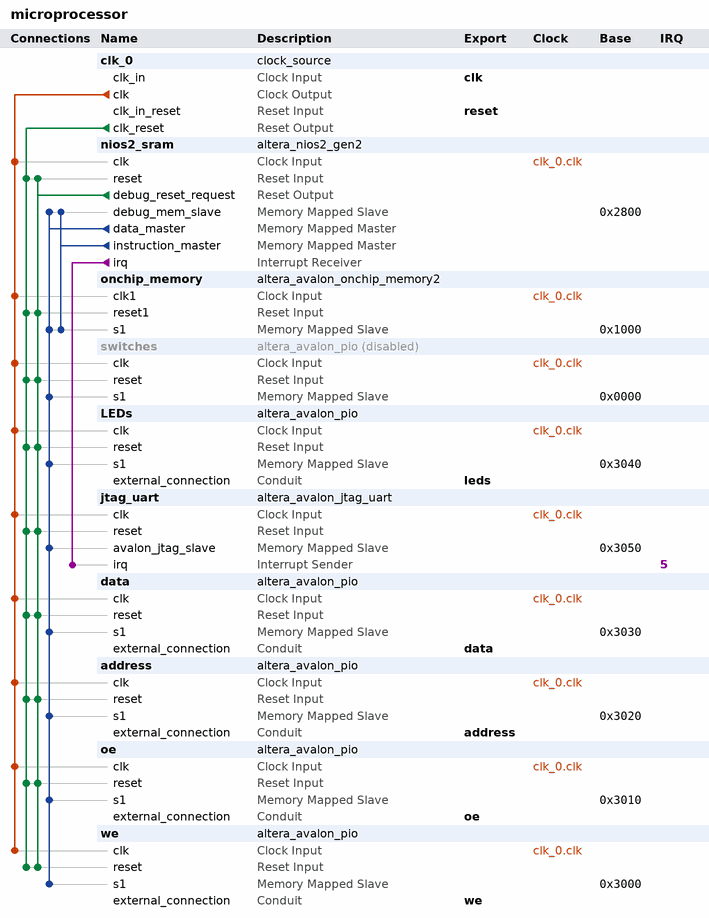
[diagram p0: system contents]
# Platform Designer (Qsys) system microprocessor, Cyclone V 5CSEMA5F31C6
# Parameters at their usual value, and those the tool derives, are not listed.
package require -exact qsys 15.1
create_system microprocessor
set_project_property DEVICE_FAMILY {Cyclone V}
set_project_property DEVICE 5CSEMA5F31C6

add_instance clk_0 clock_source 15.1
set_instance_parameter_value clk_0 clockFrequency 50000000

add_instance nios2_sram altera_nios2_gen2 15.1
set_instance_parameter_value nios2_sram dcache_size 2048
set_instance_parameter_value nios2_sram exceptionSlave onchip_memory.s1
set_instance_parameter_value nios2_sram icache_size 4096
set_instance_parameter_value nios2_sram impl Tiny
set_instance_parameter_value nios2_sram resetSlave onchip_memory.s1

add_instance onchip_memory altera_avalon_onchip_memory2 15.1
set_instance_parameter_value onchip_memory dataWidth 32
set_instance_parameter_value onchip_memory dualPort false
set_instance_parameter_value onchip_memory initMemContent true
set_instance_parameter_value onchip_memory initializationFileName onchip_mem.hex
set_instance_parameter_value onchip_memory memorySize 4096

add_instance switches altera_avalon_pio 15.1
set_instance_property switches ENABLED false
set_instance_parameter_value switches direction Input
set_instance_parameter_value switches width 8

add_instance LEDs altera_avalon_pio 15.1
set_instance_parameter_value LEDs direction Output
set_instance_parameter_value LEDs width 8

add_instance jtag_uart altera_avalon_jtag_uart 15.1
set_instance_parameter_value jtag_uart simInteractiveOptions NO_INTERACTIVE_WINDOWS

add_instance data altera_avalon_pio 15.1
set_instance_parameter_value data direction InOut
set_instance_parameter_value data width 8

add_instance address altera_avalon_pio 15.1
set_instance_parameter_value address direction Output
set_instance_parameter_value address width 8

add_instance oe altera_avalon_pio 15.1
set_instance_parameter_value oe direction Output
set_instance_parameter_value oe width 1

add_instance we altera_avalon_pio 15.1
set_instance_parameter_value we direction Output
set_instance_parameter_value we width 1

# connections
add_connection clk_0.clk address.clk clock
add_connection clk_0.clk data.clk clock
add_connection clk_0.clk jtag_uart.clk clock
add_connection clk_0.clk LEDs.clk clock
add_connection clk_0.clk nios2_sram.clk clock
add_connection clk_0.clk oe.clk clock
add_connection clk_0.clk onchip_memory.clk1 clock
add_connection clk_0.clk switches.clk clock
add_connection clk_0.clk we.clk clock
add_connection clk_0.clk_reset address.reset reset
add_connection clk_0.clk_reset data.reset reset
add_connection clk_0.clk_reset jtag_uart.reset reset
add_connection clk_0.clk_reset LEDs.reset reset
add_connection clk_0.clk_reset nios2_sram.reset reset
add_connection clk_0.clk_reset oe.reset reset
add_connection clk_0.clk_reset onchip_memory.reset1 reset
add_connection clk_0.clk_reset switches.reset reset
add_connection clk_0.clk_reset we.reset reset
add_connection nios2_sram.debug_reset_request address.reset reset
add_connection nios2_sram.debug_reset_request data.reset reset
add_connection nios2_sram.debug_reset_request jtag_uart.reset reset
add_connection nios2_sram.debug_reset_request LEDs.reset reset
add_connection nios2_sram.debug_reset_request nios2_sram.reset reset
add_connection nios2_sram.debug_reset_request oe.reset reset
add_connection nios2_sram.debug_reset_request onchip_memory.reset1 reset
add_connection nios2_sram.debug_reset_request switches.reset reset
add_connection nios2_sram.debug_reset_request we.reset reset
add_connection nios2_sram.data_master address.s1 avalon
set_connection_parameter_value nios2_sram.data_master/address.s1 baseAddress 0x3020
add_connection nios2_sram.data_master data.s1 avalon
set_connection_parameter_value nios2_sram.data_master/data.s1 baseAddress 0x3030
add_connection nios2_sram.data_master jtag_uart.avalon_jtag_slave avalon
set_connection_parameter_value nios2_sram.data_master/jtag_uart.avalon_jtag_slave baseAddress 0x3050
add_connection nios2_sram.data_master LEDs.s1 avalon
set_connection_parameter_value nios2_sram.data_master/LEDs.s1 baseAddress 0x3040
add_connection nios2_sram.data_master nios2_sram.debug_mem_slave avalon
set_connection_parameter_value nios2_sram.data_master/nios2_sram.debug_mem_slave baseAddress 0x2800
add_connection nios2_sram.data_master oe.s1 avalon
set_connection_parameter_value nios2_sram.data_master/oe.s1 baseAddress 0x3010
add_connection nios2_sram.data_master onchip_memory.s1 avalon
set_connection_parameter_value nios2_sram.data_master/onchip_memory.s1 baseAddress 0x1000
add_connection nios2_sram.data_master switches.s1 avalon
set_connection_parameter_value nios2_sram.data_master/switches.s1 baseAddress 0x0000
add_connection nios2_sram.data_master we.s1 avalon
set_connection_parameter_value nios2_sram.data_master/we.s1 baseAddress 0x3000
add_connection nios2_sram.instruction_master nios2_sram.debug_mem_slave avalon
set_connection_parameter_value nios2_sram.instruction_master/nios2_sram.debug_mem_slave baseAddress 0x2800
add_connection nios2_sram.instruction_master onchip_memory.s1 avalon
set_connection_parameter_value nios2_sram.instruction_master/onchip_memory.s1 baseAddress 0x1000
add_connection nios2_sram.irq jtag_uart.irq interrupt
set_connection_parameter_value nios2_sram.irq/jtag_uart.irq irqNumber 5

# exported interfaces
add_interface address conduit end
set_interface_property address EXPORT_OF address.external_connection
add_interface clk clock sink
set_interface_property clk EXPORT_OF clk_0.clk_in
add_interface data conduit end
set_interface_property data EXPORT_OF data.external_connection
add_interface leds conduit end
set_interface_property leds EXPORT_OF LEDs.external_connection
add_interface oe conduit end
set_interface_property oe EXPORT_OF oe.external_connection
add_interface reset reset sink
set_interface_property reset EXPORT_OF clk_0.clk_in_reset
add_interface we conduit end
set_interface_property we EXPORT_OF we.external_connection

set_interconnect_requirement {$system} qsys_mm.clockCrossingAdapter HANDSHAKE
set_interconnect_requirement {$system} qsys_mm.enableEccProtection FALSE
set_interconnect_requirement {$system} qsys_mm.insertDefaultSlave FALSE
set_interconnect_requirement {$system} qsys_mm.maxAdditionalLatency 1

save_system microprocessor.qsys
